# Altium schematic sheet IR.SchDoc: IR Module
size A4; DrawnBy: djb216; Organization: ENEL429 Group 9; Address1: ECE Department; Address2: University of Canterbury; Address3: Christchurch 8041; Address4: New Zealand; Revision: 2; SheetNumber: 5; SheetTotal: 5
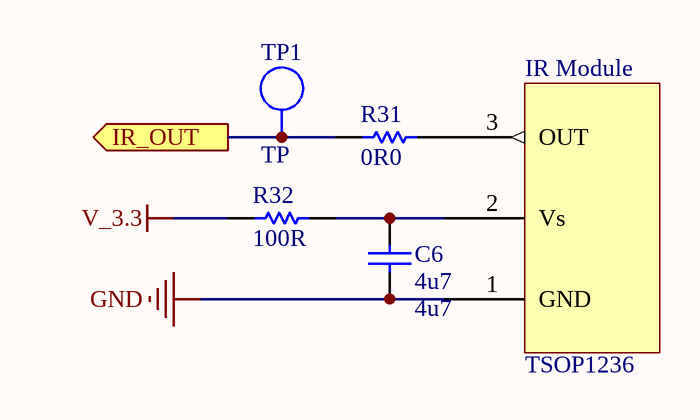
[diagram p0: IR.SchDoc]

## Parts
C6  4u7  [0603]
IR_Module  TSOP1236  [TSOP1236 IR Receiver]
R31  0R0  [0603]  (no BOM)
R32  100R  [0603]
TP1  TP  [TEST_POINT_4X2MM]  (no BOM)

## Ports
IR_OUT (out)

## Nets
GND: C6.2 IR_Module.1(GND)
V_3.3: R32.1
IR_OUT: R31.1 TP1.1 ; port IR_OUT
NetC6_1: C6.1 IR_Module.2(Vs) R32.2
NetIR_Module_3: IR_Module.3(OUT) R31.2

## Notes on the sheet
- Title
- Drawn by:
- Date:
- Time:
- Revision:
- Sheet
- of
- File:

## Library data of the parts
C6 = CP_4u7 0603: CAP CER 4.7UF 10V X5R 0603; Manufacturer: Taiyo Yuden LMK107BJ475KA-T; Value: 4u7; Part Number: CP_4u7 0603; Component Kind: Standard; Component Type: Standard; Designator: CP_4u7 0603; Pin Count: 2; LatestRevisionDate: 29 May 08; Supplier 1: Digi-Key; Supplier Part Number 1: 587-1441-1-ND; Simulation: CAP
IR_Module = TSOP1236: Manufacturer: VISHAY; Manufacturer PN: TSOP1236; Supplier Part Number 1: 4913048; Supplier 1: Element14
R31 = RS_0R0 0603: RES 0.0 OHM 1/10W 5% 0603 SMD; Manufacturer: Rohm; Manufacturer PN: MCR03EZPJ000; LatestRevisionDate: 3 Jun 08; Supplier 1: Digi-Key; Supplier Part Number 1: RHM0.0GTR-ND; Value: 0R0; Part Number: RS_0R0 0603; Component Type: Standard (No BOM); Designator: RS_0R0 0603; Pin Count: 2; Signal Integrity: Res; Simulation: RESISTOR
R32 = RS_100R 0603: RES 100 OHM 1/10W 1% 0603 SMD; Manufacturer: ROHM; Manufacturer PN: MCR03EZPFX1000; Value: 100R; Part Number: RS_100R 0603; Component Kind: Standard; Component Type: Standard; Designator: RS_100R 0603; Pin Count: 2; LatestRevisionDate: n/a; Supplier 1: Digi-Key; Supplier Part Number 1: RHM100HTR-ND; Signal Integrity: Res; Simulation: RESISTOR
TP1 = TP_TESTPOINT: Test-Point; Value: TP; Part Number: TP_TESTPOINT; Component Type: Standard (No BOM); Designator: TP_TESTPOINT; Pin Count: 1; LatestRevisionDate: 29 May 08; Manufacturer PN: *; Manufacturer: *; Supplier 1: Digi-Key; Supplier Part Number 1: 5016KTR-ND